# EAGLE design Input_Board (EAGLE 6.2)
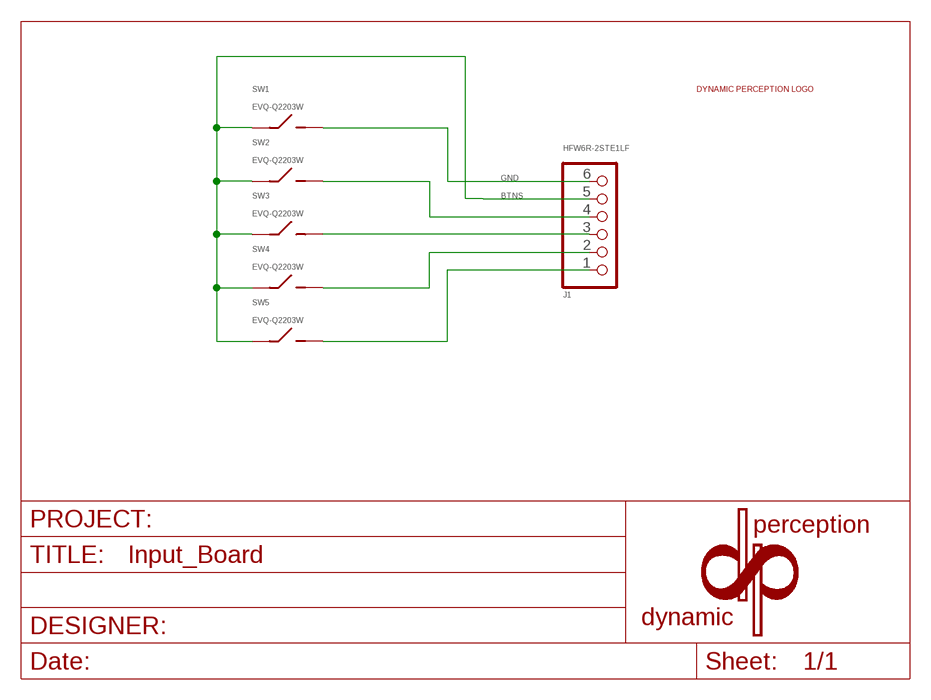
[diagram p0: schematic, sheet 1]

## Parts
FRAME1  DYNAMIC_PERCEPTION_FRAMEPCB_INFO  [DYNAMIC_PERCEPTION_FRAME]
J1  HFW6R-2STE1LF  PH_1X06FFC  [HFW6R-2STE1LF]
LOGO2  DYNAMIC_PERCEPTION_LOGOMICRO  [DP_LOGO_MICRO]
SW1  EVQ-Q2203W  SPSTEVQ-Q2203W  [EVQ-Q2203W]
SW2  EVQ-Q2203W  SPSTEVQ-Q2203W  [EVQ-Q2203W]
SW3  EVQ-Q2203W  SPSTEVQ-Q2203W  [EVQ-Q2203W]
SW4  EVQ-Q2203W  SPSTEVQ-Q2203W  [EVQ-Q2203W]
SW5  EVQ-Q2203W  SPSTEVQ-Q2203W  [EVQ-Q2203W]

## Nets
BTNS: J1.5 SW1.1(A) SW1.2(A) SW2.1(A) SW2.2(A) SW3.1(A) SW3.2(A) SW4.1(A) SW4.2(A) SW5.1(A) SW5.2(A)
GND: J1.6 SW1.3(B) SW1.4(B)
N$1: J1.4 SW2.3(B) SW2.4(B)
N$2: J1.3 SW3.3(B) SW3.4(B)
N$3: J1.2 SW4.3(B) SW4.4(B)
N$4: J1.1 SW5.3(B) SW5.4(B)

## Library data of the parts
FRAME1 = PP_Aesthetics:DYNAMIC_PERCEPTION_FRAME: Frame for PCB and Schematic; DNAME: Parker Dillmann; PNAME: D-PAD Input; REVNUM: REV 0
J1 = PP_Connectors:PH_1X06: 6 pin connectors
LOGO2 = PP_Aesthetics:DYNAMIC_PERCEPTION_LOGO: Dynamic Perception Logo
SW1-SW5 = PP_Electromechanical:SPST: SPST Switches

## Board
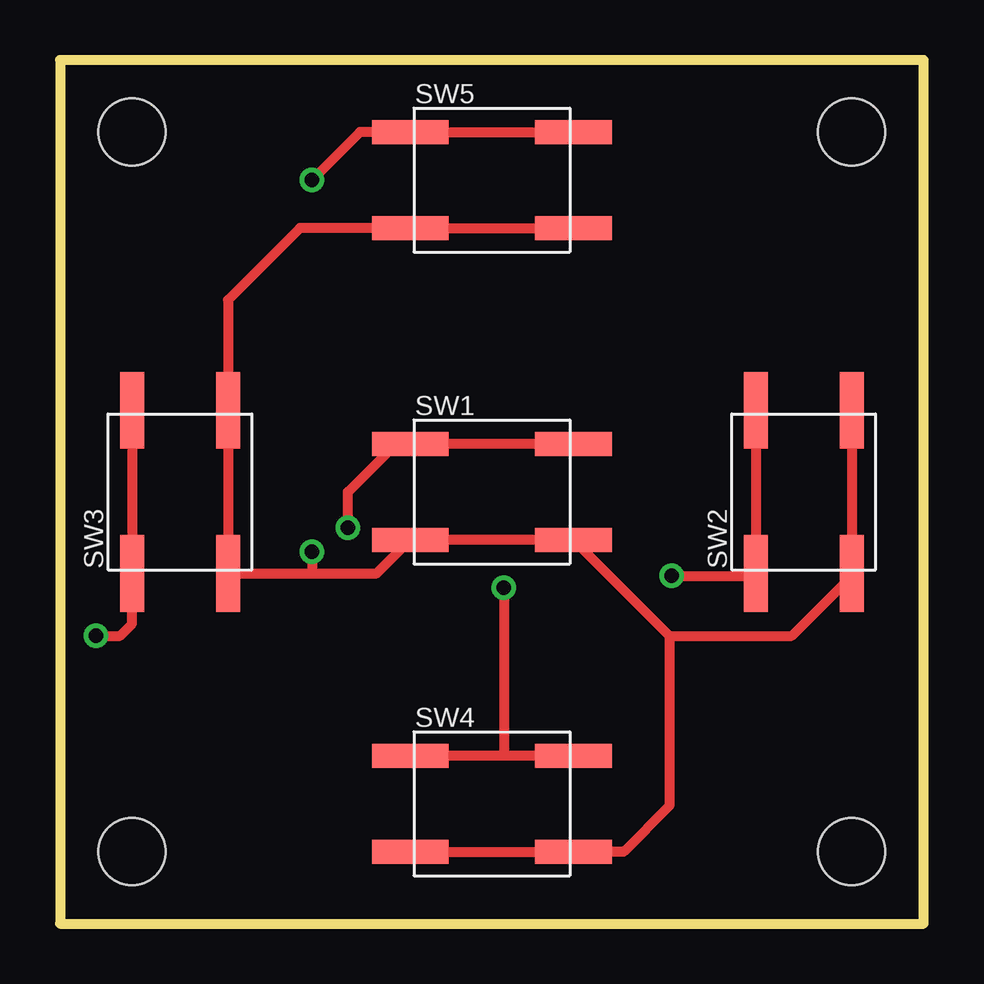
[diagram p1: board, top side]
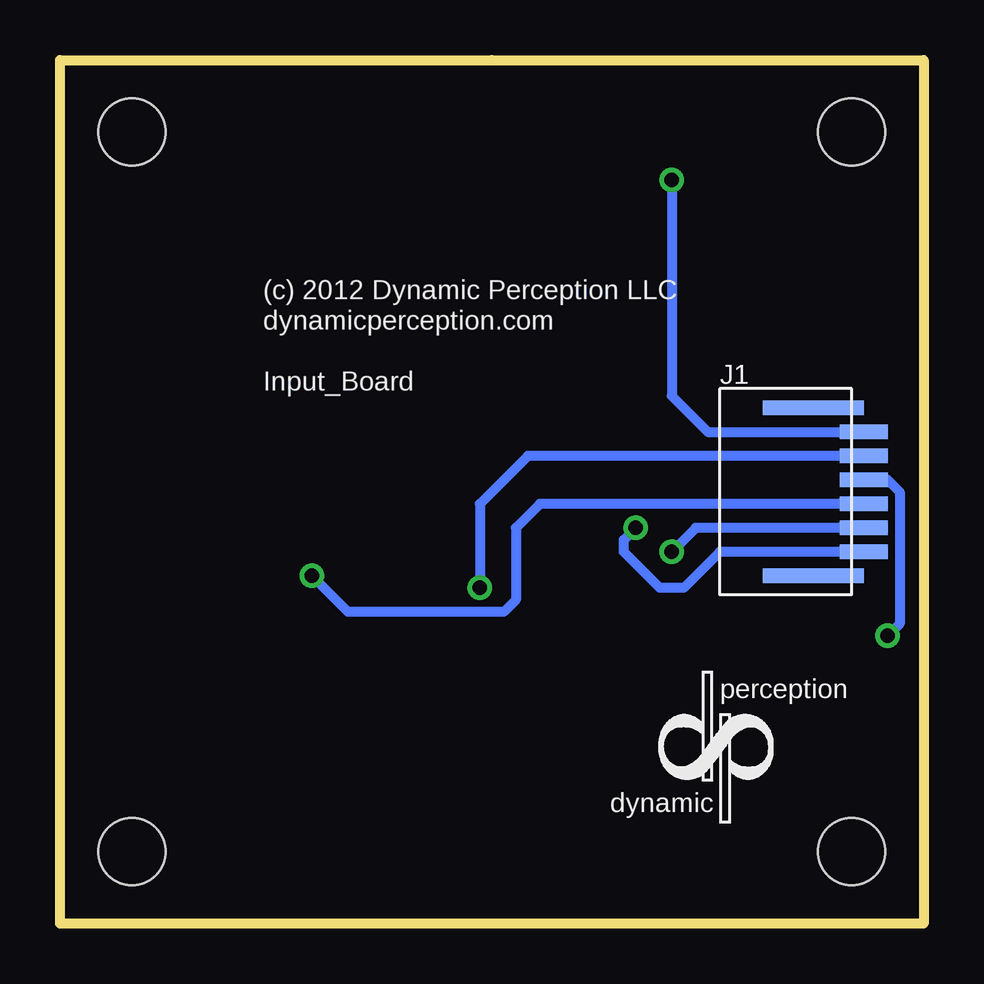
[diagram p2: board, bottom side, seen from below]

Size 36 x 36 mm. Coordinates in mm from the lower left corner, seen from the top.
Outline: 18,36 0,36 0,0 36,0 36,36 18,36
Copper layers (1*16): Top 0.035mm / dielectric 1.5mm / Bottom 0.035mm
Design rules: minimum track width 7mil, minimum drill 8mil, track to track 7mil, track to pad 7mil, pad to pad 7mil, via to via 7mil, smd to smd 7mil, copper to edge 10mil, drill to drill 8mil, minimum pad ring 1mil, minimum via ring 8mil, stop-mask expansion 4mil, vias tented up to drill 25mil, thermal gap 10mil
Holes 2.8 mm at 3,33 33,3 3,3 33,33

### Footprints (pad centres in the part's own frame; a part is rotated, then mirrored left to right if it is on the bottom)
HFW6R-2STE1LF = smd 0.6 x 2: 1 -2.5,0; 2 -1.5,0; 3 -0.5,0; 4 0.5,0; 5 1.5,0; 6 2.5,0 | smd 0.6 x 4.2: PAD0 -3.5,-2.1; PAD1 3.5,-2.1
EVQ-Q2203W = smd 3.2 x 1: 1 -3.4,-2; 2 3.4,-2; 3 -3.4,2; 4 3.4,2

### Placement (x,y rotation side)
FRAME1  28.8,26.03 0 bottom
J1  2.5,18 270 bottom
LOGO2  8.5,8 0 bottom
SW1  18,18 0 top
SW2  31,18 90 top
SW3  5,18 90 top
SW4  18,5 0 top
SW5  18,31 0 top

### Tracks (layer width: path | path; a pad name or v marks a point on that pad's centre or on a via)
BTNS  (via drill 0.6)
  Top 0.406: SW5.2 SW5.1 10,29 7,26 SW3.2 SW3.1 10.5,14.6 | SW2.2 SW2.1 33,14.5 30.5,12 25.4,12 | SW4.1 SW4.2 23.5,3 25.4,4.9 25.4,12 | 10.5,14.6 13.2,14.6 SW1.1 SW1.2 25.4,12 | v10.5,15.5 10.5,14.6
  Bottom 0.406: J1.5 9.5,16.5 v10.5,15.5
GND  (via drill 0.6)
  Top 0.406: SW1.4 SW1.3 | SW1.3 14,20 | 14,20 SW1.3 | v12,16.5 12,18 14,20
  Bottom 0.406: J1.6 8.5,15.5 10,14 11,14 12.5,15.5 12.5,16 v12,16.5
N$1  (via drill 0.6)
  Top 0.406: SW2.4 SW2.3 28.9,14.5 v25.5,14.5
  Bottom 0.406: J1.4 16,17.5 17,16.5 17,13.5 17.5,13 24,13 v25.5,14.5
N$2  (via drill 0.6)
  Top 0.406: SW3.4 SW3.3 3,12.5 2.5,12 v1.5,12
  Bottom 0.406: J1.3 1.5,18.5 1,18 1,12.5 v1.5,12
N$3  (via drill 0.6)
  Top 0.406: SW4.4 18.5,7 | 18.5,7 SW4.3 | v18.5,14 18.5,7
  Bottom 0.406: J1.2 16.5,19.5 18.5,17.5 v18.5,14
N$4  (via drill 0.6)
  Top 0.406: SW5.4 SW5.3 12.5,33 v10.5,31
  Bottom 0.406: v10.5,31 10.5,22 9,20.5 J1.1